# Altium project 6S_Smart batt-DEMO.PrjPcb
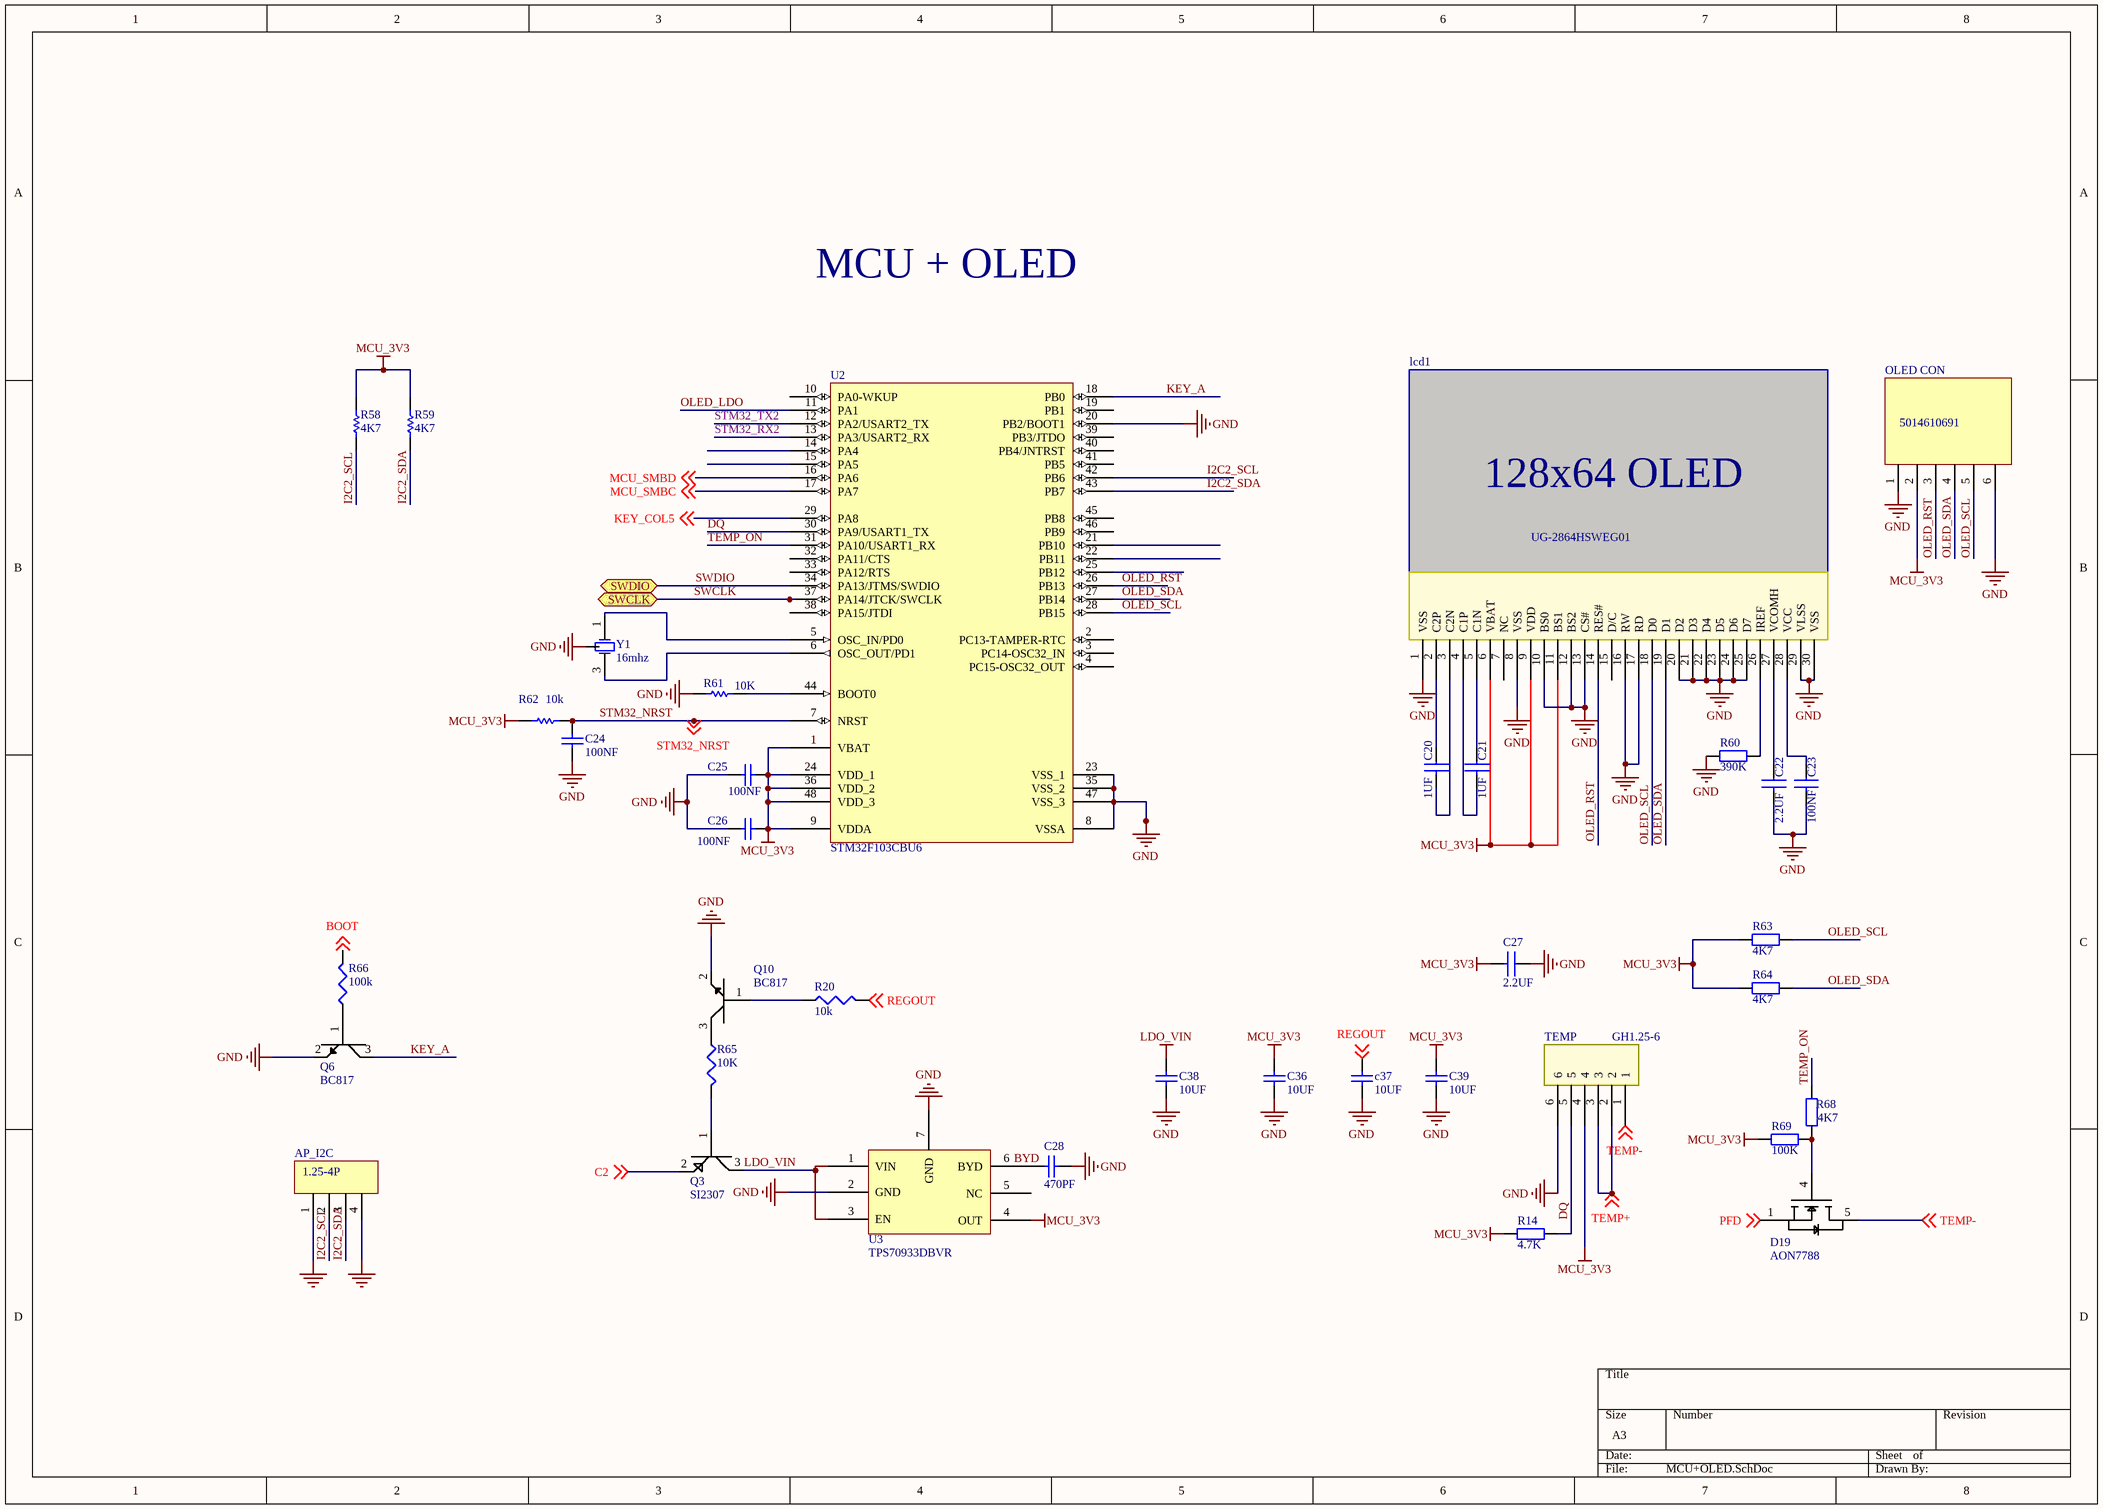
[diagram p0: MCU+OLED.SchDoc]
3 sheets, 149 parts. Net scope: flat (ports and power ports of the same name join across sheets).
Board file: 6sdemo.PcbDoc
Sheets:
  MCU+OLED.SchDoc
  BQ78350.SchDoc
  BQ76930.SchDoc

## Sheet MCU+OLED.SchDoc
size A3

### Parts
AP_I2C  1.25-4P  [GH1.25-4P]
C20  1UF  [0603c]
C21  1UF  [0603c]
C22  2.2UF  [0603c]
C23  100NF  [0603c]
C24  100nf  [0402CAP]
C25  value 100NF  [0402CAP]  (hidden comment: Cap)
C26  value 100NF  [0402CAP]  (hidden comment: Cap)
C27  2.2UF  [0603c]
C28  470PF  [0402CAP]
C36  10UF  [0805CAP]
c37  10UF  [0805CAP]
C38  10UF  [0805CAP]
C39  10UF  [0805CAP]
D19  AON7788  [DFN3x3_8L]
lcd1  UG-2864HSWEG01  [1.3OLED]
OLED_CON  5014610691  [5014610691]
Q3  SI2307  [SOT-23 - duplicate]
Q6  BC817  [SOT-23 - duplicate]
Q10  BC817  [SOT-23 - duplicate]
R14  4.7K  [0402r]
R20  10k  [0402R]
R58  4K7  [0402R]
R59  4K7  [0402R]
R60  390K  [0402r]
R61  10K  [0402R]
R62  10k  [0402R]
R63  4K7  [0402r]
R64  4K7  [0402r]
R65  10K  [0402r]
R66  100k  [0402r]
R68  4K7  [0402r]
R69  100K  [0402r]
TEMP  GH1.25-6  [GH1.25-6]
U2  STM32F103CBU6  [QFN48]
U3  TPS70933DBVR  [MLF-6]
Y1  16mhz  [RESONATOR]

### Ports
SWCLK, SWDIO

### Nets
GND: AP_I2C.1 AP_I2C.4 C22.2 C23.2 C24.2 C25.1 C26.1 C27.1 C28.2 C36.1 c37.1 C38.1 C39.1 lcd1.1(VSS) lcd1.8(VSS) lcd1.10(BS0) lcd1.12(BS2) lcd1.13(CS#) lcd1.16(RW) lcd1.17(RD) lcd1.20(D2) lcd1.21(D3) lcd1.22(D4) lcd1.23(D5) lcd1.24(D6) lcd1.25(D7) lcd1.29(VLSS) lcd1.30(VSS) OLED_CON.1 OLED_CON.6 Q6.2(emitter) Q10.2(emitter) R60.1 R61.2 TEMP.6 U2.8(VSSA) U2.20(PB2/BOOT1) U2.23(VSS_1) U2.35(VSS_2) U2.47(VSS_3) U3.2(GND) U3.7(GND) Y1.2(GND)
LDO_VIN: C38.2 Q3.3(collector) U3.1(VIN) U3.3(EN)
MCU_3V3: C25.2 C26.2 C27.2 C36.2 C39.2 lcd1.6(VBAT) lcd1.9(VDD) lcd1.11(BS1) OLED_CON.2 R14.1 R58.1 R59.1 R62.2 R63.1 R64.1 R69.2 TEMP.4 U2.1(VBAT) U2.9(VDDA) U2.24(VDD_1) U2.36(VDD_2) U2.48(VDD_3) U3.4(OUT)
BOOT: R66.2 ; off-sheet BOOT
C2: Q3.2(emitter) ; off-sheet C2
DQ: R14.2 TEMP.5 U2.30(PA9/USART1_TX)
I2C2_SCL: AP_I2C.2 R58.2 U2.42(PB6)
I2C2_SDA: AP_I2C.3 R59.2 U2.43(PB7)
KEY_A: Q6.3(collector) U2.18(PB0)
KEY_COL5: U2.29(PA8) ; off-sheet KEY_COL5
MCU_SMBC: U2.17(PA7) ; off-sheet MCU_SMBC
MCU_SMBD: U2.16(PA6) ; off-sheet MCU_SMBD
OLED_LDO: U2.11(PA1)
OLED_RST: lcd1.14(RES#) OLED_CON.3 U2.26(PB13)
OLED_SCL: lcd1.18(D0) OLED_CON.5 R63.2 U2.28(PB15)
OLED_SDA: lcd1.19(D1) OLED_CON.4 R64.2 U2.27(PB14)
PFD: D19.1(S) ; off-sheet PFD
REGOUT: c37.2 R20.2 ; off-sheet REGOUT
STM32_NRST: C24.1 R62.1 U2.7(NRST) ; off-sheet STM32_NRST
STM32_RX2: U2.13(PA3/USART2_RX)
STM32_TX2: U2.12(PA2/USART2_TX)
SWCLK: U2.37(PA14/JTCK/SWCLK) ; port SWCLK
SWDIO: U2.34(PA13/JTMS/SWDIO) ; port SWDIO
TEMP+: TEMP.2 TEMP.3 ; off-sheet TEMP+
TEMP-: D19.5(D) TEMP.1 ; off-sheet TEMP-
TEMP_ON: R68.2 U2.31(PA10/USART1_RX)
NetC20_1: C20.1 lcd1.2(C2P)
NetC20_2: C20.2 lcd1.3(C2N)
NetC21_1: C21.1 lcd1.5(C1N)
NetC21_2: C21.2 lcd1.4(C1P)
NetC22_1: C22.1 lcd1.27(VCOMH)
NetC23_1: C23.1 lcd1.28(VCC)
NetC28_1: C28.1 U3.6(BYD)
NetD19_4: D19.4(G) R68.1 R69.1
Netlcd1_26: lcd1.26(IREF) R60.2
NetQ3_1: Q3.1(base) R65.2
NetQ6_1: Q6.1(base) R66.1
NetQ10_1: Q10.1(base) R20.1
NetQ10_3: Q10.3(collector) R65.1
NetR61_1: R61.1 U2.44(BOOT0)
NetU2_5: U2.5(OSC_IN/PD0) Y1.1(OSC1)
NetU2_6: U2.6(OSC_OUT/PD1) Y1.3(OSC2)

Not connected (* = marked no-connect by the designer): lcd1 7(NC) 15(D/C); U2 2(PC13-TAMPER-RTC) 3(PC14-OSC32_IN) 4(PC15-OSC32_OUT) 10(PA0-WKUP) 14(PA4) 15(PA5) 19(PB1) 21(PB10) 22(PB11) 25(PB12) 32(PA11/CTS) 33(PA12/RTS) 38(PA15/JTDI) 39(PB3/JTDO) 40(PB4/JNTRST) 41(PB5) 45(PB8) 46(PB9); U3 5(NC)

### Notes on the sheet
- MCU + OLED
- Labels drawn without touching a wire or pin: BYD
- (in symbol UG-2864HSWEG01) 128x64 OLED

### Library data of the parts
C20-C22 C27 = C1005X5R1H104K: CAP CER .10UF 50V X5R 10% 0402; Manufacturer: TDK Corporation; Capacitance: 0.1礔; Value: 100nF; .Checked PCB: used; Tolerance: ?0%; Category: Capacitors; Supplier Part Number: 445-5942-1-ND; Manufacturer Part Number: C1005X5R1H104K; Operating Temperature: -55癈 ~ 85癈; Package / Case: 0402 (1005 Metric); Price 1k [$]: 0.02340; .Checked SCH: used; Voltage - Rated: 50V; Supplier: Digikey; Supplier 1: Digi-Key; Supplier Part Number 1: 445-5942-1-ND; RoHS: RoHS Compliant; Stock 1: 106926; Pricing 1: 1=0.27, 10=0.18, 100=0.072, 250=0.05176, 500=0.0369, 1000=0.027 (USD); Temperature Coefficient: X5R; Mounting Type: Surface Mount, MLCC; Applications: General Purpose; Ratings: -; Size / Dimension: 0.039" L x 0.020" W (1.00mm x 0.50mm); Height - Seated (Max): -; Thickness (Max): 0.022" (0.55mm); Lead Spacing: -; Features: -; Packaging: Cut Tape (CT); Lead Style: -; ComponentLink1URL: http://www.tdk.co.jp/tefe02/e412_c.pdf; ComponentLink1Description: http://www.tdk.co.jp/tefe02/e412_c.pdf
C23 = C1005X5R1H104K: CAP CER .10UF 50V X5R 10% 0402; Manufacturer: TDK Corporation; Capacitance: 0.1礔; .Checked PCB: used; Tolerance: ?0%; Category: Capacitors; Supplier Part Number: 445-5942-1-ND; Manufacturer Part Number: C1005X5R1H104K; Operating Temperature: -55癈 ~ 85癈; Package / Case: 0402 (1005 Metric); Price 1k [$]: 0.02340; Value: 100nF; .Checked SCH: used; Voltage - Rated: 50V; Supplier: Digikey; Supplier 1: Digi-Key; Supplier Part Number 1: 445-5942-1-ND; RoHS: RoHS Compliant; Stock 1: 106926; Pricing 1: 1=0.27, 10=0.18, 100=0.072, 250=0.05176, 500=0.0369, 1000=0.027 (USD); Temperature Coefficient: X5R; Mounting Type: Surface Mount, MLCC; Applications: General Purpose; Ratings: -; Size / Dimension: 0.039" L x 0.020" W (1.00mm x 0.50mm); Height - Seated (Max): -; Thickness (Max): 0.022" (0.55mm); Lead Spacing: -; Features: -; Packaging: Cut Tape (CT); Lead Style: -; ComponentLink1URL: http://www.tdk.co.jp/tefe02/e412_c.pdf; ComponentLink1Description: http://www.tdk.co.jp/tefe02/e412_c.pdf
C24-C26 = Cap: Capacitor; Published: 8-Jun-2000; LatestRevisionDate: 17-Jul-2002; LatestRevisionNote: Re-released for DXP Platform.; PackageReference: RAD-0.3; Publisher: Altium Limited; PackageDescription: Radial Cap, Thru-Hole; 2 Leads; 0.3 in Pin Spacing
  C24: Value: 100NF
C28 = Cap: Capacitor; Value: 100pF; Published: 8-Jun-2000; LatestRevisionDate: 17-Jul-2002; LatestRevisionNote: Re-released for DXP Platform.; PackageReference: RAD-0.3; Publisher: Altium Limited; PackageDescription: Radial Cap, Thru-Hole; 2 Leads; 0.3 in Pin Spacing
C36 c37 C38 C39 = Cap: Value: 100pF; Published: 8-Jun-2000; LatestRevisionDate: 17-Jul-2002; LatestRevisionNote: Re-released for DXP Platform.; PackageReference: RAD-0.3; Publisher: Altium Limited; PackageDescription: Radial Cap, Thru-Hole; 2 Leads; 0.3 in Pin Spacing
Q3 = MMBT3906
Q6 Q10 = BC718
R14 R60 R63 R64 R68 R69 = Res2: Resistor; Value: 1K; Published: 8-Jun-2000; LatestRevisionDate: 17-Jul-2002; LatestRevisionNote: Re-released for DXP Platform.; PackageReference: AXIAL-0.4; Publisher: Altium Limited; PackageDescription: Axial Device, Thru-Hole; 2 Leads; 0.4 in Pin Spacing
R20 R65 R66 = RMCF0402FT4K99: RES TF 4.99K OHM 1% 1/16W 0402; Manufacturer: Stackpole Electronics Inc; Power (Watts): 0.063W, 1/16W; Tolerance: ?%; Value: 4k99; .Checked PCB: used; Temperature Coefficient: ?00ppm/癈; Category: Resistors; Supplier Part Number: RMCF0402FT4K99CT-ND; Manufacturer Part Number: RMCF0402FT4K99; Package / Case: 0402 (1005 Metric); Price 1k [$]: 0.00384; Resistance (Ohms): 4.99K; .Checked SCH: used; Supplier: Digikey; Supplier 1: Digi-Key; Supplier Part Number 1: RMCF0402FT4K99CT-ND; RoHS: RoHS Compliant; Stock 1: 48509; Pricing 1: 1=0.04, 10=0.025, 50=0.0138, 100=0.0105, 250=0.0078, 500=0.00576, 1000=0.00384 (USD); Composition: Thick Film; Features: -; Size / Dimension: 0.039" L x 0.020" W (1.00mm x 0.50mm); Height: 0.016" (0.40mm); Number of Terminations: 2; Packaging: Cut Tape (CT); ComponentLink1URL: http://www.seielect.com/Catalog/SEI-RMCF.pdf; ComponentLink1Description: http://www.seielect.com/Catalog/SEI-RMCF.pdf
R58 R59 R61 R62 = Res Semi: Semiconductor Resistor; Published: 8-Jun-2000; LatestRevisionDate: 17-Jul-2002; LatestRevisionNote: Re-released for DXP Platform.; PackageReference: AXIAL-0.5; Publisher: Altium Limited; PackageDescription: Axial Device, Thru-Hole; 2 Leads; 0.5 in Pin Spacing
  R61: Value: 10K
U2 = STM32F103C8T6: STM32 ARM-based 32-bit MCU with 64 Kbytes Flash, 48-pin LQFP, Industrial Temperature; Published: 30-May-2008; DatasheetVersion: rev6, Mar-2008; PackageVersion: Mar-2008; PackageReference: LQFP48; Publisher: Altium Limited; PackageDescription: 48-Pin Low-Profile Quad Flat Pack, 7 x 7 mm Body, 0.5 mm Pitch (LQFP48); ComponentLink1Description: Manufacturer Link; ComponentLink1URL: www.st.com/stm32; ComponentLink2Description: Datasheet; ComponentLink2URL: http://www.st.com/stonline/products/literature/ds/13587.pdf
U3 = MIC5219-3V3
Y1 = XTAL: Crystal Oscillator; Published: 8-Jun-2000; LatestRevisionDate: 17-Jul-2002; LatestRevisionNote: Re-released for DXP Platform.; PackageReference: R38; Publisher: Altium Limited; PackageDescription: Crystal, Thru-Hole; 2 Leads; Body 3.1 x 8.2 mm (Dia.xH)

## Sheet BQ78350.SchDoc
size A3
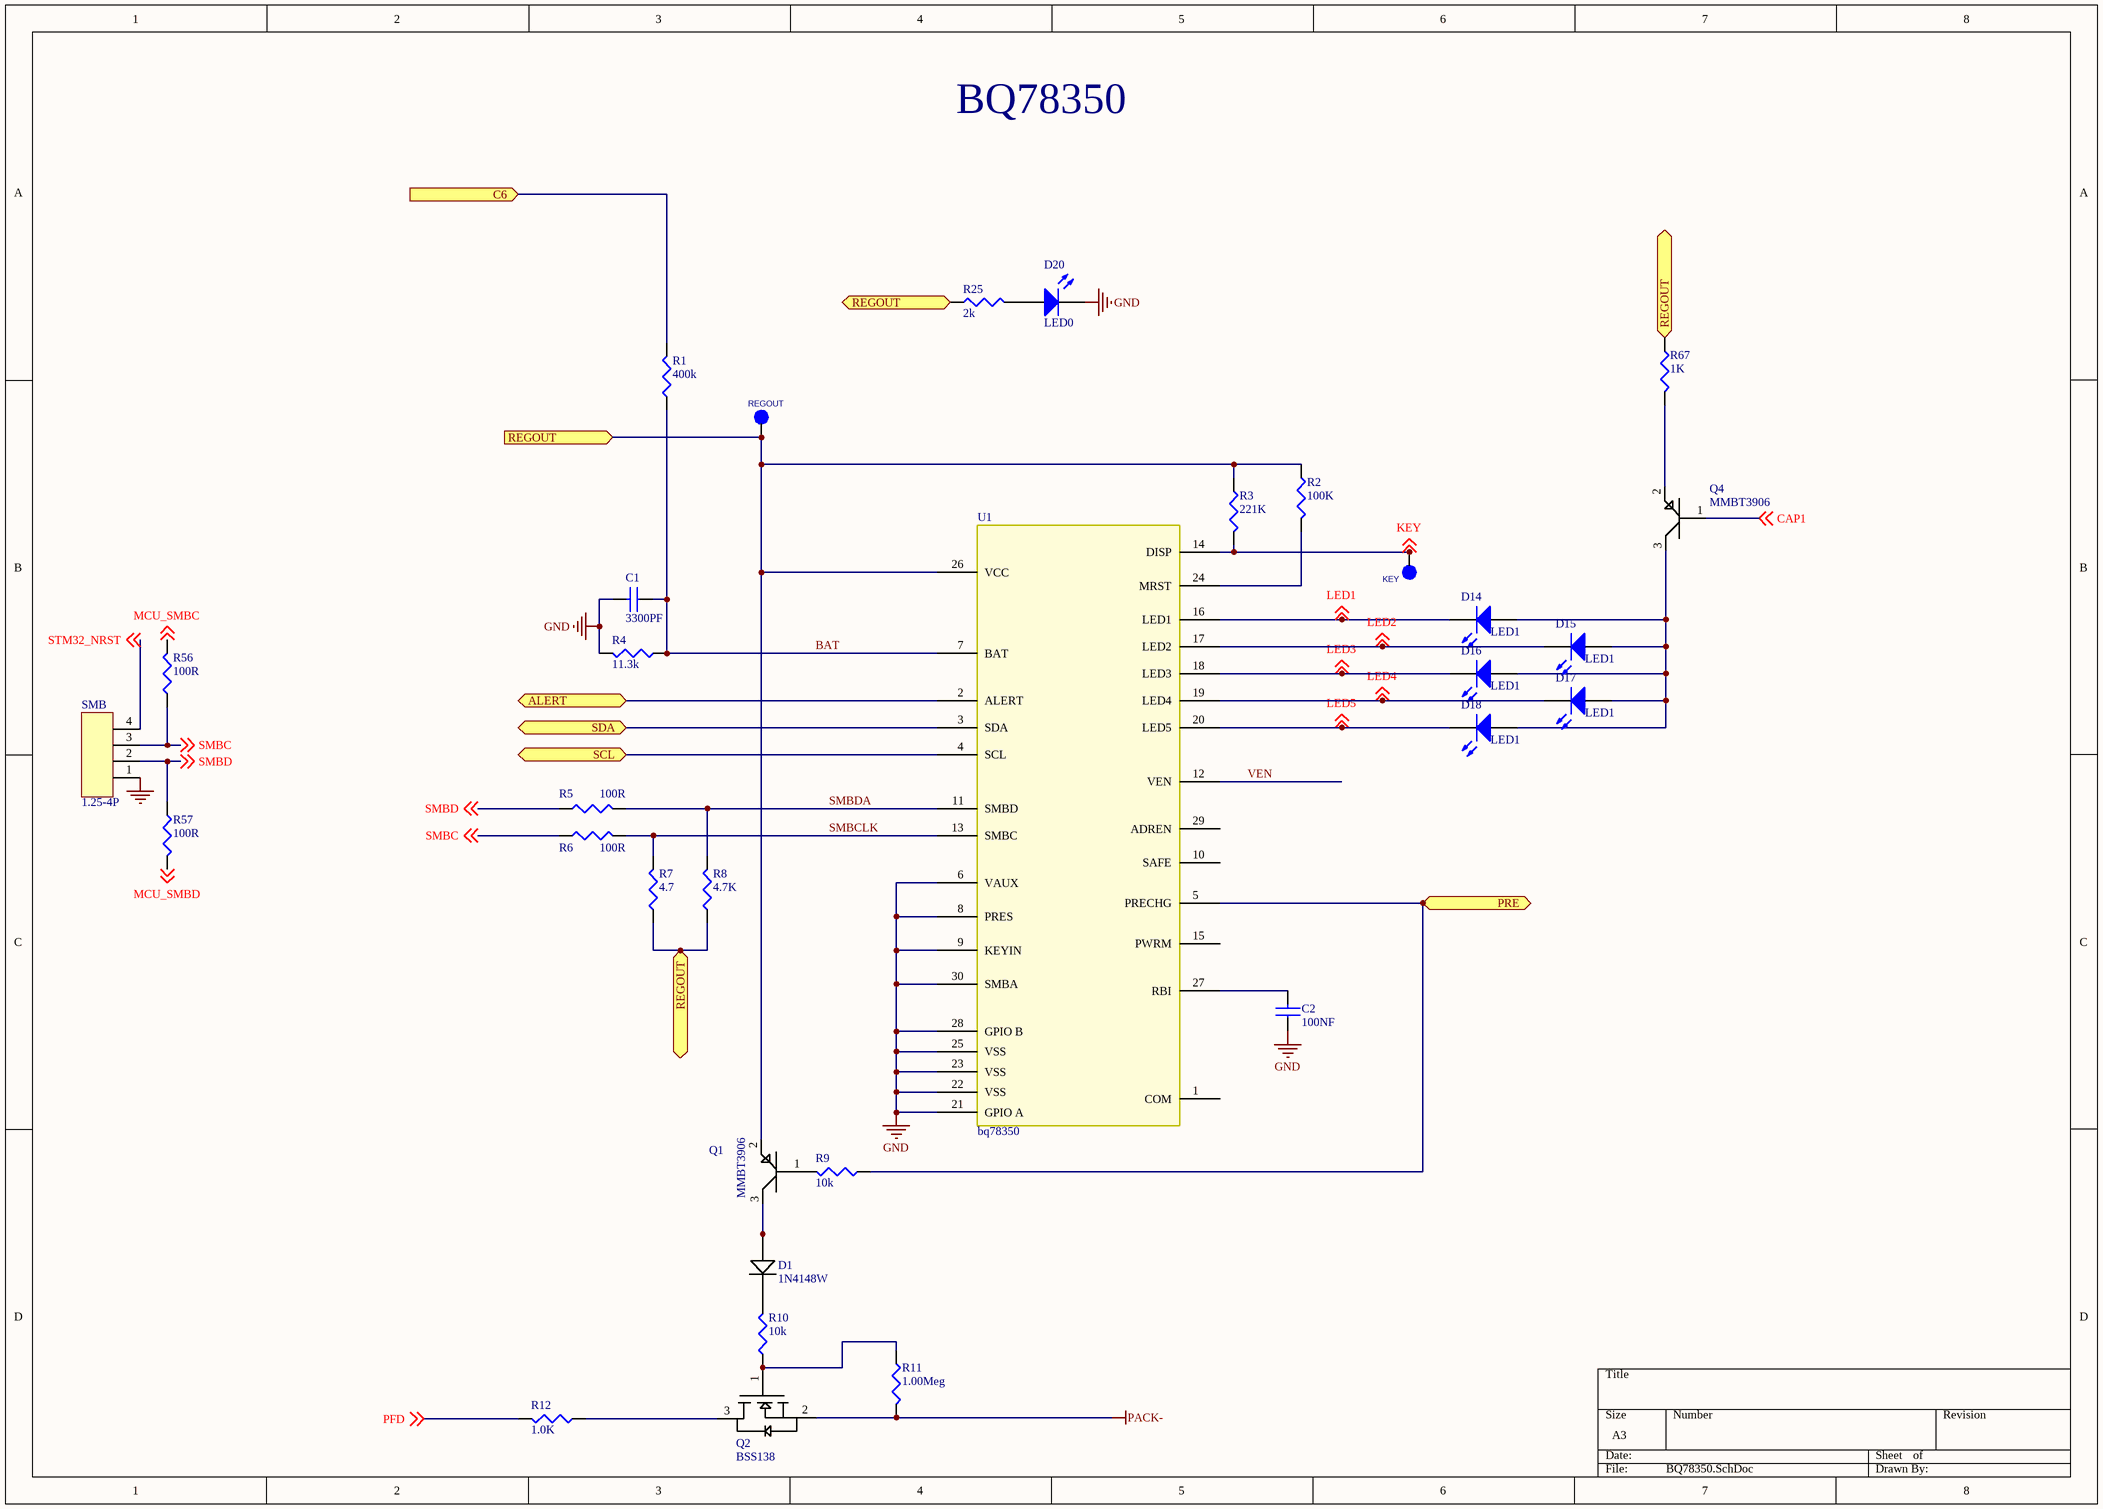
[diagram p1: BQ78350.SchDoc]

### Parts
C1  3300PF  [0402cap]
C2  100NF  [0402cap]
D1  1N4148W  [SOD-123]
D14  LED1  [0603-LED-YE]
D15  LED1  [0603-LED-YE]
D16  LED1  [0603-LED-YE]
D17  LED1  [0603-LED-YE]
D18  LED1  [0603-LED-YE]
D20  LED0  [0603-led-b]
KEY  tpad_020  [tpad_020]  (value not drawn)
Q1  MMBT3906  [SOT-23 - duplicate]
Q2  BSS138  [SOT-23 - duplicate]
Q4  MMBT3906  [SOT-23 - duplicate]
R1  400k  [0603R]
R2  100K  [0603R]
R3  221K  [0603R]
R4  11.3k  [0603R]
R5  100R  [0603R]
R6  100R  [0603R]
R7  4.7  [0603R]
R8  4.7K  [0603R]
R9  10k  [0603R]
R10  10k  [0603R]
R11  1.00Meg  [0603R]
R12  1.0K  [R0805]
R25  2k  [0603R]
R56  100R  [0402r]
R57  100R  [0402r]
R67  1K  [0603R]
REGOUT  tpad_020  [tpad_020]  (value not drawn)
SMB  1.25-4P  [GH1.25-4P]
U1  bq78350  [TSSOP30]

### Ports
ALERT, C6 (in), PRE, REGOUT (in), SCL, SDA

### Nets
GND: C1.2 C2.1 D20.C R4.2 SMB.1 U1.6(VAUX) U1.8(PRES) U1.9(KEYIN) U1.21(GPIO_A) U1.22(VSS) U1.23(VSS) U1.25(VSS) U1.28(GPIO_B) U1.30(SMBA)
PACK-: Q2.2(S) R11.2
BAT: C1.1 R1.1 R4.1 U1.7(BAT)
CAP1: Q4.1(base) ; off-sheet CAP1
KEY: KEY.1(Pin1) R3.2 U1.14(DISP) ; off-sheet KEY
LED1: D14.C U1.16(LED1) ; off-sheet LED1
LED2: D15.C U1.17(LED2) ; off-sheet LED2
LED3: D16.C U1.18(LED3) ; off-sheet LED3
LED4: D17.C U1.19(LED4) ; off-sheet LED4
LED5: D18.C U1.20(LED5) ; off-sheet LED5
MCU_SMBC: R56.2 ; off-sheet MCU_SMBC
MCU_SMBD: R57.2 ; off-sheet MCU_SMBD
PFD: R12.2 ; off-sheet PFD
SCL: U1.4(SCL) ; port SCL
SDA: U1.3(SDA) ; port SDA
SMBC: R6.1 R56.1 SMB.3 ; off-sheet SMBC
SMBCLK: R6.2 R7.2 U1.13(SMBC)
SMBD: R5.1 R57.1 SMB.2 ; off-sheet SMBD
SMBDA: R5.2 R8.2 U1.11(SMBD)
STM32_NRST: SMB.4 ; off-sheet STM32_NRST
VEN: U1.12(VEN)
NetC2_2: C2.2 U1.27(RBI)
NetD1_A: D1.A Q1.3(collector)
NetD1_K: D1.K R10.2
NetD14_A: D14.A D15.A D16.A D17.A D18.A Q4.3(collector)
NetD20_A: D20.A R25.2
NetQ1_1: Q1.1(base) R9.2
NetQ1_2: Q1.2(emitter) R2.1 R3.1 R7.1 R8.1 R25.1 R67.1 REGOUT.1(Pin1) U1.26(VCC) ; port REGOUT
NetQ2_1: Q2.1(G) R10.1 R11.1
NetQ2_3: Q2.3(D) R12.1
NetQ4_2: Q4.2(emitter) R67.2
NetR1_2: R1.2 ; port C6
NetR2_2: R2.2 U1.24(MRST)
NetR9_1: R9.1 U1.5(PRECHG) ; port PRE
NetU1_2: U1.2(ALERT) ; port ALERT

Not connected (* = marked no-connect by the designer): U1 1(COM) 10(SAFE) 15(PWRM) 29(ADREN)

### Notes on the sheet
- BQ78350

### Library data of the parts
C1 = C1005X5R1H104K: as C20 on sheet MCU+OLED; Category: Capacitors; Manufacturer Part Number: C1005X5R1H104K; Operating Temperature: -55癈 ~ 85癈; Package / Case: 0402 (1005 Metric); Price 1k [$]: 0.02340; .Checked SCH: used; Voltage - Rated: 50V; Supplier Part Number: 445-5942-1-ND; Supplier: Digikey; Supplier 1: Digi-Key; Supplier Part Number 1: 445-5942-1-ND; RoHS: RoHS Compliant; Stock 1: 106926; Pricing 1: 1=0.27, 10=0.18, 100=0.072, 250=0.05176, 500=0.0369, 1000=0.027 (USD); Temperature Coefficient: X5R; Mounting Type: Surface Mount, MLCC; Applications: General Purpose; Ratings: -; Size / Dimension: 0.039" L x 0.020" W (1.00mm x 0.50mm); Height - Seated (Max): -; Thickness (Max): 0.022" (0.55mm); Lead Spacing: -; Features: -; Packaging: Cut Tape (CT); Lead Style: -; ComponentLink1URL: http://www.tdk.co.jp/tefe02/e412_c.pdf; ComponentLink1Description: http://www.tdk.co.jp/tefe02/e412_c.pdf
C2 = C1005X5R1H104K: as C23 on sheet MCU+OLED; Category: Capacitors; Manufacturer Part Number: C1005X5R1H104K; Operating Temperature: -55癈 ~ 85癈; Package / Case: 0402 (1005 Metric); Price 1k [$]: 0.02340; Value: 100nF; .Checked SCH: used; Voltage - Rated: 50V; Supplier Part Number: 445-5942-1-ND; Supplier: Digikey; Supplier 1: Digi-Key; Supplier Part Number 1: 445-5942-1-ND; RoHS: RoHS Compliant; Stock 1: 106926; Pricing 1: 1=0.27, 10=0.18, 100=0.072, 250=0.05176, 500=0.0369, 1000=0.027 (USD); Temperature Coefficient: X5R; Mounting Type: Surface Mount, MLCC; Applications: General Purpose; Ratings: -; Size / Dimension: 0.039" L x 0.020" W (1.00mm x 0.50mm); Height - Seated (Max): -; Thickness (Max): 0.022" (0.55mm); Lead Spacing: -; Features: -; Packaging: Cut Tape (CT); Lead Style: -; ComponentLink1URL: http://www.tdk.co.jp/tefe02/e412_c.pdf; ComponentLink1Description: http://www.tdk.co.jp/tefe02/e412_c.pdf
D14-D18 = LED1: Typical RED GaAs LED; Published: 8-Jun-2000; LatestRevisionDate: 08-Jul-2005; LatestRevisionNote: Mech Layer 1 removed.; PackageReference: LED-1; Publisher: Altium Limited; PackageDescription: LED; 2 Leads
D20 = LED0: Typical INFRARED GaAs LED; Published: 8-Jun-2000; LatestRevisionDate: 08-Jul-2005; LatestRevisionNote: Mech Layer 1 removed.; PackageReference: LED-0; Publisher: Altium Limited; PackageDescription: LED; 2 Leads
KEY REGOUT = TESTLOOP: TEST POINT PAD 0.5MM DIA SMT, NO PART TO ORDER; CLASS: IO; AGILE_PN: 211-77484; ASSY_OPT: DNP; CAD_APPROVED: Yes; ROHS: Yes; HEIGHT: 0.1MM
R1-R12 R25 R56 R57 R67 = RMCF0402FT4K99: as R20 on sheet MCU+OLED; Category: Resistors; Supplier Part Number: RMCF0402FT4K99CT-ND; Manufacturer Part Number: RMCF0402FT4K99; Package / Case: 0402 (1005 Metric); Price 1k [$]: 0.00384; Resistance (Ohms): 4.99K; .Checked SCH: used; Supplier: Digikey; Supplier 1: Digi-Key; Supplier Part Number 1: RMCF0402FT4K99CT-ND; RoHS: RoHS Compliant; Stock 1: 48509; Pricing 1: 1=0.04, 10=0.025, 50=0.0138, 100=0.0105, 250=0.0078, 500=0.00576, 1000=0.00384 (USD); Composition: Thick Film; Features: -; Size / Dimension: 0.039" L x 0.020" W (1.00mm x 0.50mm); Height: 0.016" (0.40mm); Number of Terminations: 2; Packaging: Cut Tape (CT); ComponentLink1URL: http://www.seielect.com/Catalog/SEI-RMCF.pdf; ComponentLink1Description: http://www.seielect.com/Catalog/SEI-RMCF.pdf

## Sheet BQ76930.SchDoc
size A3
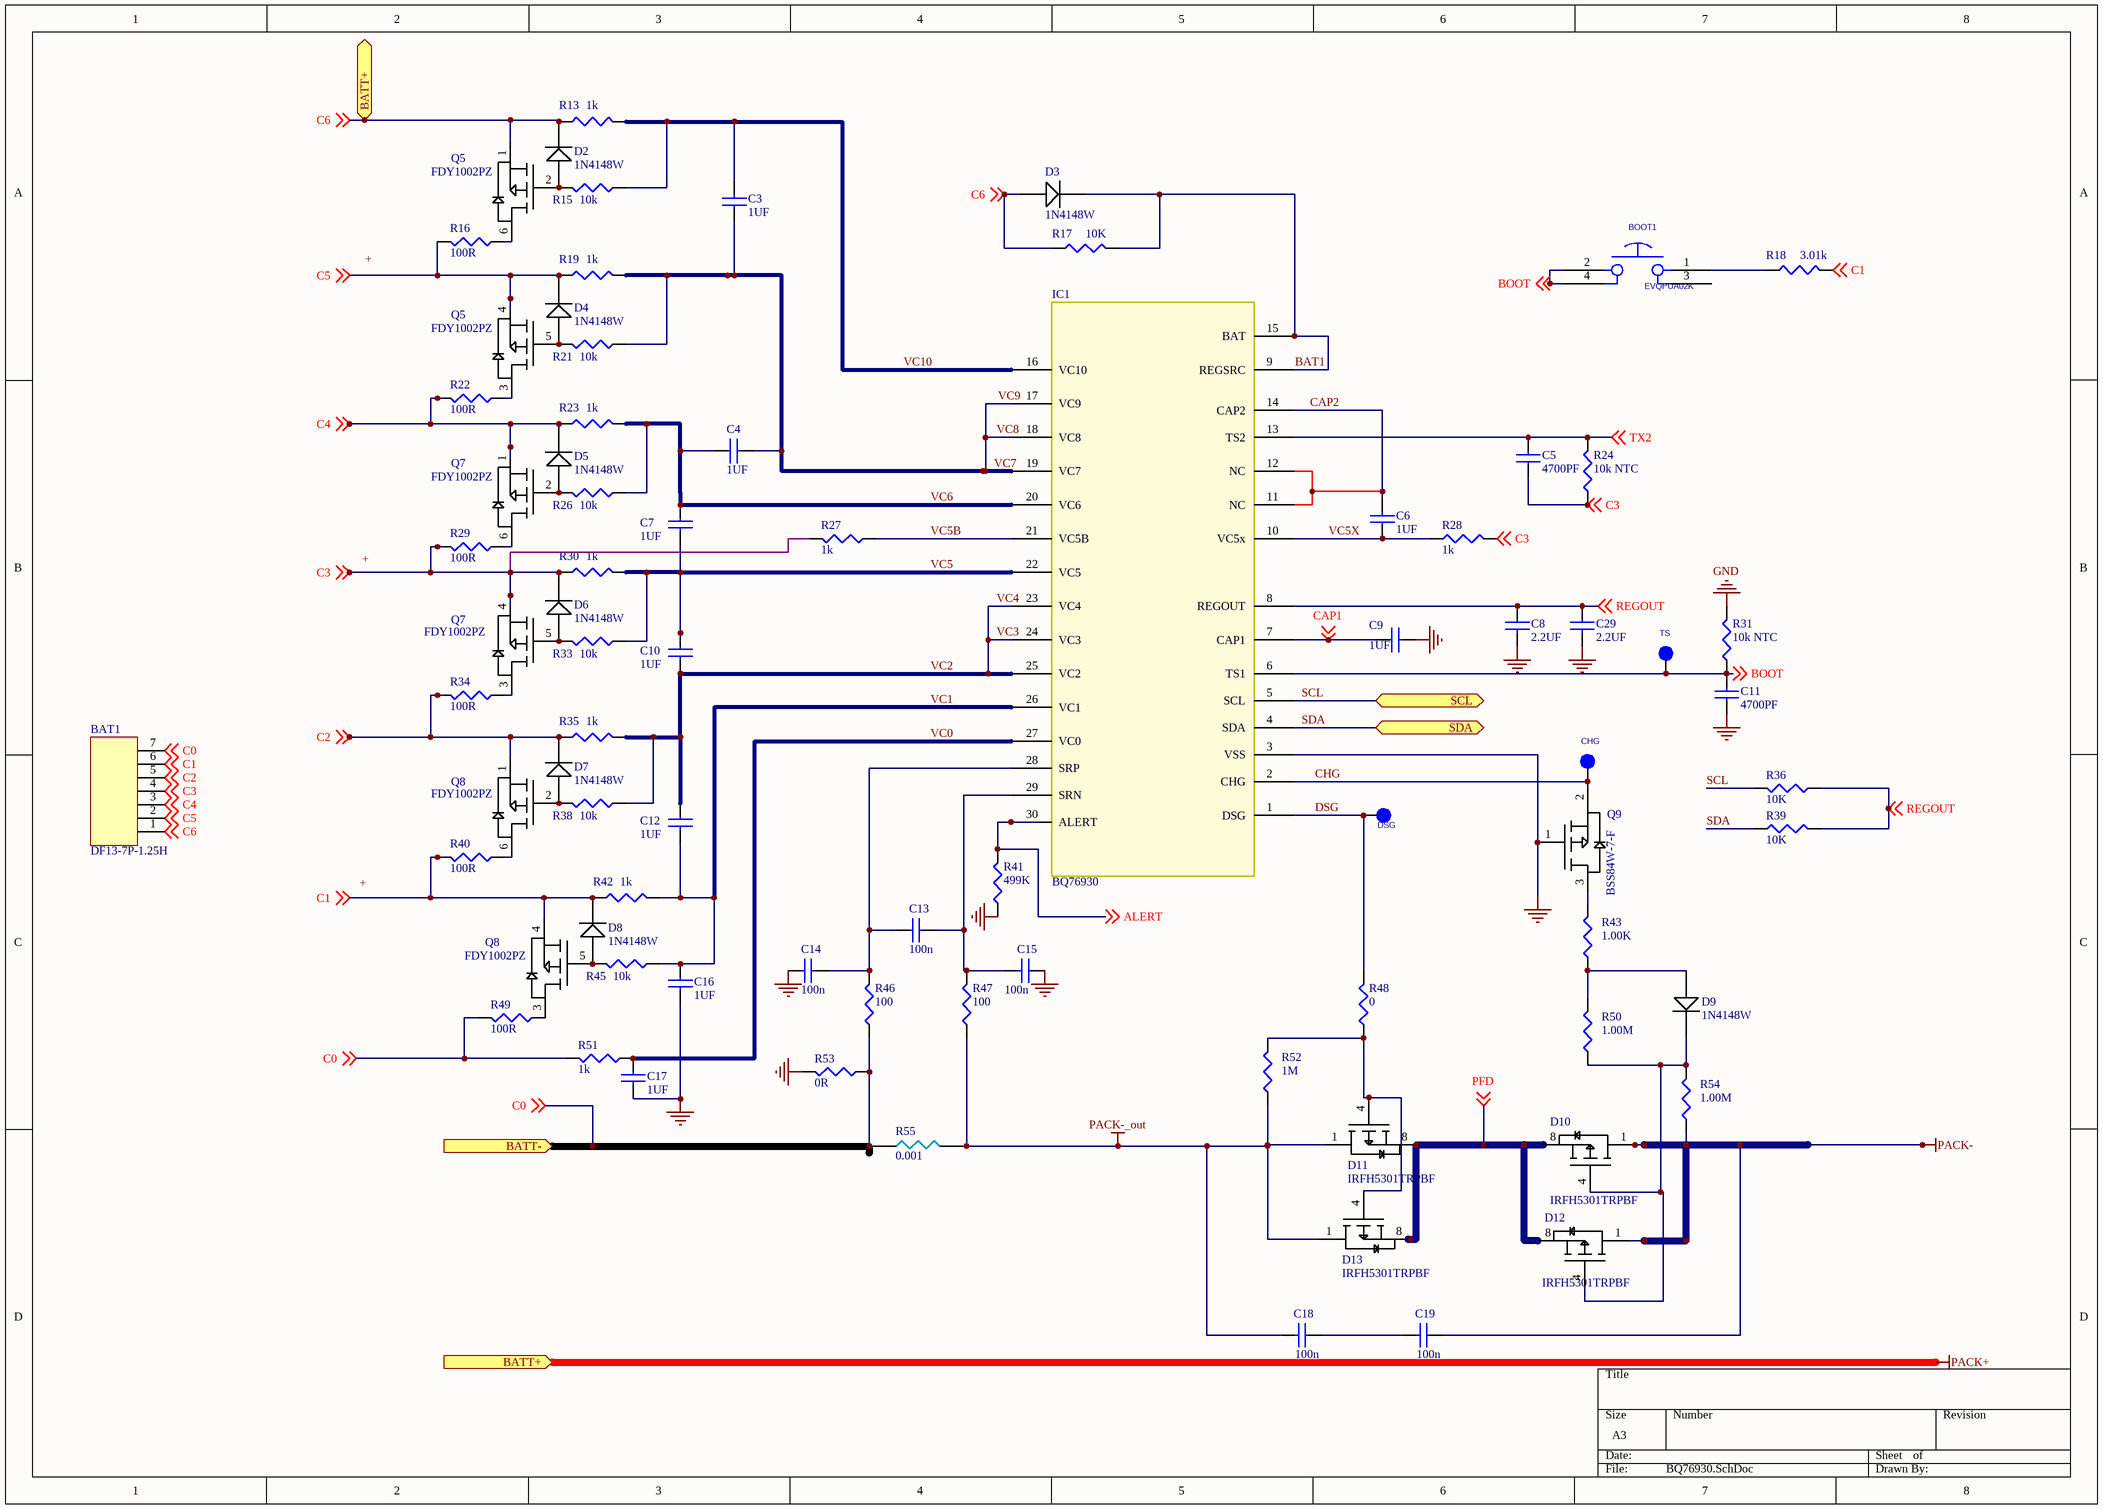
[diagram p2: BQ76930.SchDoc]

### Parts
(Parts that share a designator on the sheet are numbered #1, #2 ... from top to bottom, then left to right.)
BAT1  DF13-7P-1.25H  [DF13-7P-1.25H]
BOOT1  EVQPUA02K  [SKRPAB]
C3  1UF  [0603c]
C4  1UF  [0603c]
C5  4700PF  [0603C]
C6  1UF  [0603c]
C7  1UF  [0603c]
C8  2.2UF  [0603c]
C9  1UF  [0603c]
C10  1UF  [0603c]
C11  4700PF  [0603C]
C12  1UF  [0603c]
C13  100n  [0402CAP]
C14  100n  [0402CAP]
C15  100n  [0402CAP]
C16  1UF  [0603c]
C17  1UF  [0603c]
C18  100n  [0402CAP]
C19  100n  [0402CAP]
C29  2.2UF  [0603c]
CHG  tpad_020  [tpad_020]  (value not drawn)
D2  1N4148W  [SOD323]
D3  1N4148W  [SOD-123]
D4  1N4148W  [SOD323]
D5  1N4148W  [SOD323]
D6  1N4148W  [SOD323]
D7  1N4148W  [SOD323]
D8  1N4148W  [SOD323]
D9  1N4148W  [SOD-123]
D10  IRFH5301TRPBF  [SON5x6]
D11  IRFH5301TRPBF  [SON5x6]
D12  IRFH5301TRPBF  [SON5x6]
D13  IRFH5301TRPBF  [SON5x6]
DSG  tpad_020  [tpad_020]  (value not drawn)
IC1  BQ76930  [TSSOP30]
Q5#1  FDY1002PZ
Q5#2  FDY1002PZ  [DFN2*2-6L]
Q7#1  FDY1002PZ
Q7#2  FDY1002PZ  [DFN2*2-6L]
Q8#1  FDY1002PZ
Q8#2  FDY1002PZ  [DFN2*2-6L]
Q9  BSS84W-7-F  [SOT-323]
R13  1k  [0603r]
R15  10k  [0603r]
R16  100R  [0603r]
R17  10K  [0603R]
R18  3.01k  [0603R]
R19  1k  [0603r]
R21  10k  [0603r]
R22  100R  [0603r]
R23  1k  [0603r]
R24  10k NTC  [0603R]
R26  10k  [0603r]
R27  1k  [0603r]
R28  1k  [0603R]
R29  100R  [0603r]
R30  1k  [0603r]
R31  10k NTC  [0603R]
R33  10k  [0603r]
R34  100R  [0603r]
R35  1k  [0603r]
R36  10K  [0603R]
R38  10k  [0603r]
R39  10K  [0603R]
R40  100R  [0603r]
R41  499K  [0603R]
R42  1k  [0603r]
R43  1.00K  [0603R]
R45  10k  [0603r]
R46  100  [0603R]
R47  100  [0603R]
R48  0  [0603R]
R49  100R  [0603r]
R50  1.00M  [0603R]
R51  1k  [0603r]
R52  1M  [0603R]
R53  0R  [0805L]
R54  1.00M  [0603R]
R55  0.001  [Dale_WSR-3]
TS  tpad_020  [tpad_020]  (value not drawn)

### Ports
BATT+ (in), BATT- (in), SCL, SDA

### Nets
GND: C8.2 C9.2 C11.1 C14.1 C15.1 C16.2 C17.2 C29.2 IC1.3(VSS) Q9.1(G) R31.2 R41.1 R53.2
PACK+: BAT1.1 D2.C(K) D3.A Q5#1.1(S) R13.1 R17.1 ; off-sheet C6, port BATT+  [also labelled C6]
PACK-: C19.1 D10.1(S) D12.1(S) R54.1
PACK-_out: C18.2 D11.1(S) D13.1(S) R47.1 R52.1 R55.2
ALERT: IC1.30(ALERT) R41.2 ; off-sheet ALERT
BAT1: D3.K IC1.9(REGSRC) IC1.15(BAT) R17.2
BOOT: BOOT1.2 BOOT1.4 C11.2 IC1.6(TS1) R31.1 TS.1(Pin1) ; off-sheet BOOT
C0: BAT1.7 R46.1 R49.2 R51.2 R53.1 R55.1 ; off-sheet C0, port BATT-
C1: BAT1.6 D8.C Q8#2.4(S) R18.2 R40.2 R42.1 ; off-sheet C1
C2: BAT1.5 D7.C(K) Q8#1.1(S) R34.2 R35.1 ; off-sheet C2
C3: BAT1.4 C5.1 D6.C(K) Q7#2.4(S) R24.1 R27.2 R28.2 R29.2 R30.1 ; off-sheet C3
C4: BAT1.3 D5.C(K) Q7#1.1(S) R22.2 R23.1 ; off-sheet C4
C5: BAT1.2 D4.C(K) Q5#2.4(S) R16.2 R19.1 ; off-sheet C5
CAP1: C9.1 IC1.7(CAP1) ; off-sheet CAP1
CAP2: C6.2 IC1.11(NC) IC1.12(NC) IC1.14(CAP2)
CHG: CHG.1(Pin1) IC1.2(CHG) Q9.2(S)
DSG: DSG.1(Pin1) IC1.1(DSG) R48.2
PFD: D10.8(D) D11.8(D) D12.8(D) D13.8(D) ; off-sheet PFD
REGOUT: C8.1 C29.1 IC1.8(REGOUT) R36.1 R39.2 ; off-sheet REGOUT
SCL: IC1.5(SCL) R36.2 ; port SCL
SDA: IC1.4(SDA) R39.1 ; port SDA
TX2: C5.2 IC1.13(TS2) R24.2 ; off-sheet TX2
VC0: C17.1 IC1.27(VC0) R51.1
VC1: C12.2 C16.1 IC1.26(VC1) R42.2 R45.1
VC2: C10.2 C12.1 IC1.23(VC4) IC1.24(VC3) IC1.25(VC2) R35.2 R38.1  [also labelled VC3, VC4]
VC5: C7.2 C10.1 IC1.22(VC5) R30.2 R33.1
VC5B: IC1.21(VC5B) R27.1
VC5X: C6.1 IC1.10(VC5x) R28.1
VC6: C4.1 C7.1 IC1.20(VC6) R23.2 R26.1
VC7: C3.1 C4.2 IC1.17(VC9) IC1.18(VC8) IC1.19(VC7) R19.2 R21.1  [also labelled VC8, VC9]
VC10: C3.2 IC1.16(VC10) R13.2 R15.1
NetBOOT1_1: BOOT1.1 R18.1
NetC13_1: C13.1 C14.2 IC1.28(SRP) R46.2
NetC13_2: C13.2 C15.2 IC1.29(SRN) R47.2
NetC18_1: C18.1 C19.2
NetD2_A: D2.A Q5#1.2(G) R15.2
NetD4_A: D4.A Q5#2.5(G) R21.2
NetD5_A: D5.A Q7#1.2(G) R26.2
NetD6_A: D6.A Q7#2.5(G) R33.2
NetD7_A: D7.A Q8#1.2(G) R38.2
NetD8_A: D8.A Q8#2.5(G) R45.2
NetD9_A: D9.A R43.1 R50.2
NetD9_K: D9.K D10.4(G) D12.4(G) R50.1 R54.2
NetD11_4: D11.4(G) D13.4(G) R48.1 R52.2
NetQ5#1_6: Q5#1.6(D) R16.1
NetQ5#2_3: Q5#2.3(D) R22.1
NetQ7#1_6: Q7#1.6(D) R29.1
NetQ7#2_3: Q7#2.3(D) R34.1
NetQ8#1_6: Q8#1.6(D) R40.1
NetQ8#2_3: Q8#2.3(D) R49.1
NetQ9_3: Q9.3(D) R43.2

Not connected (* = marked no-connect by the designer): BOOT1 3

### Notes on the sheet
- Labels drawn without touching a wire or pin: +

### Library data of the parts
BOOT1 = EDGE_MOUNT_PB_SW_2: SW SPST NO PB 2.2N SIDE 12V 50MA SMT; CLASS: IC; CAD_APPROVED: Yes; MFG_NAME01: PANASONIC; AGILE_PN: 510-76838; HEIGHT: 1.95MM; ROHS: Yes; MFG_PN01: EVQPUA02K
C3-C19 C29 = C1005X5R1H104K: as C20 on sheet MCU+OLED; Category: Capacitors; Supplier Part Number: 445-5942-1-ND; Manufacturer Part Number: C1005X5R1H104K; Operating Temperature: -55癈 ~ 85癈; Package / Case: 0402 (1005 Metric); Price 1k [$]: 0.02340; .Checked SCH: used; Voltage - Rated: 50V; Supplier: Digikey; Supplier 1: Digi-Key; Supplier Part Number 1: 445-5942-1-ND; RoHS: RoHS Compliant; Stock 1: 106926; Pricing 1: 1=0.27, 10=0.18, 100=0.072, 250=0.05176, 500=0.0369, 1000=0.027 (USD); Temperature Coefficient: X5R; Mounting Type: Surface Mount, MLCC; Applications: General Purpose; Ratings: -; Size / Dimension: 0.039" L x 0.020" W (1.00mm x 0.50mm); Height - Seated (Max): -; Thickness (Max): 0.022" (0.55mm); Lead Spacing: -; Features: -; Packaging: Cut Tape (CT); Lead Style: -; ComponentLink1URL: http://www.tdk.co.jp/tefe02/e412_c.pdf; ComponentLink1Description: http://www.tdk.co.jp/tefe02/e412_c.pdf
CHG DSG TS = TESTLOOP: as KEY on sheet BQ78350; ROHS: Yes; HEIGHT: 0.1MM
D10-D13 = P_MOS_2
Q5#1 Q5#2 Q7#1 Q7#2 Q8#1 Q8#2 = BSS84-7-F
Q9 = BSS84W
R13 R15-R19 R21-R24 R26-R31 R33-R36 R38-R43 R45-R54 = RMCF0402FT4K99: as R20 on sheet MCU+OLED; Category: Resistors; Supplier Part Number: RMCF0402FT4K99CT-ND; Manufacturer Part Number: RMCF0402FT4K99; Package / Case: 0402 (1005 Metric); Price 1k [$]: 0.00384; Resistance (Ohms): 4.99K; .Checked SCH: used; Supplier: Digikey; Supplier 1: Digi-Key; Supplier Part Number 1: RMCF0402FT4K99CT-ND; RoHS: RoHS Compliant; Stock 1: 48509; Pricing 1: 1=0.04, 10=0.025, 50=0.0138, 100=0.0105, 250=0.0078, 500=0.00576, 1000=0.00384 (USD); Composition: Thick Film; Features: -; Size / Dimension: 0.039" L x 0.020" W (1.00mm x 0.50mm); Height: 0.016" (0.40mm); Number of Terminations: 2; Packaging: Cut Tape (CT); ComponentLink1URL: http://www.seielect.com/Catalog/SEI-RMCF.pdf; ComponentLink1Description: http://www.seielect.com/Catalog/SEI-RMCF.pdf
R55 = DALE_WSR3

## Nets that join several sheets
GND: MCU+OLED (43 pins), BQ78350 (14 pins), BQ76930 (13 pins)
PACK-: BQ78350 (Q2.2 R11.2), BQ76930 (C19.1 D10.1 D12.1 R54.1)
BOOT: MCU+OLED (R66.2), BQ76930 (6 pins)
C2: MCU+OLED (Q3.2), BQ76930 (5 pins)
CAP1: BQ78350 (Q4.1), BQ76930 (C9.1 IC1.7)
MCU_SMBC: MCU+OLED (U2.17), BQ78350 (R56.2)
MCU_SMBD: MCU+OLED (U2.16), BQ78350 (R57.2)
PFD: MCU+OLED (D19.1), BQ78350 (R12.2), BQ76930 (D10.8 D11.8 D12.8 D13.8)
REGOUT: MCU+OLED (c37.2 R20.2), BQ76930 (5 pins)
SCL: BQ78350 (U1.4), BQ76930 (IC1.5 R36.2)
SDA: BQ78350 (U1.3), BQ76930 (IC1.4 R39.1)
STM32_NRST: MCU+OLED (C24.1 R62.1 U2.7), BQ78350 (SMB.4)